# Altium schematic sheet POWER.SchDoc
size A3
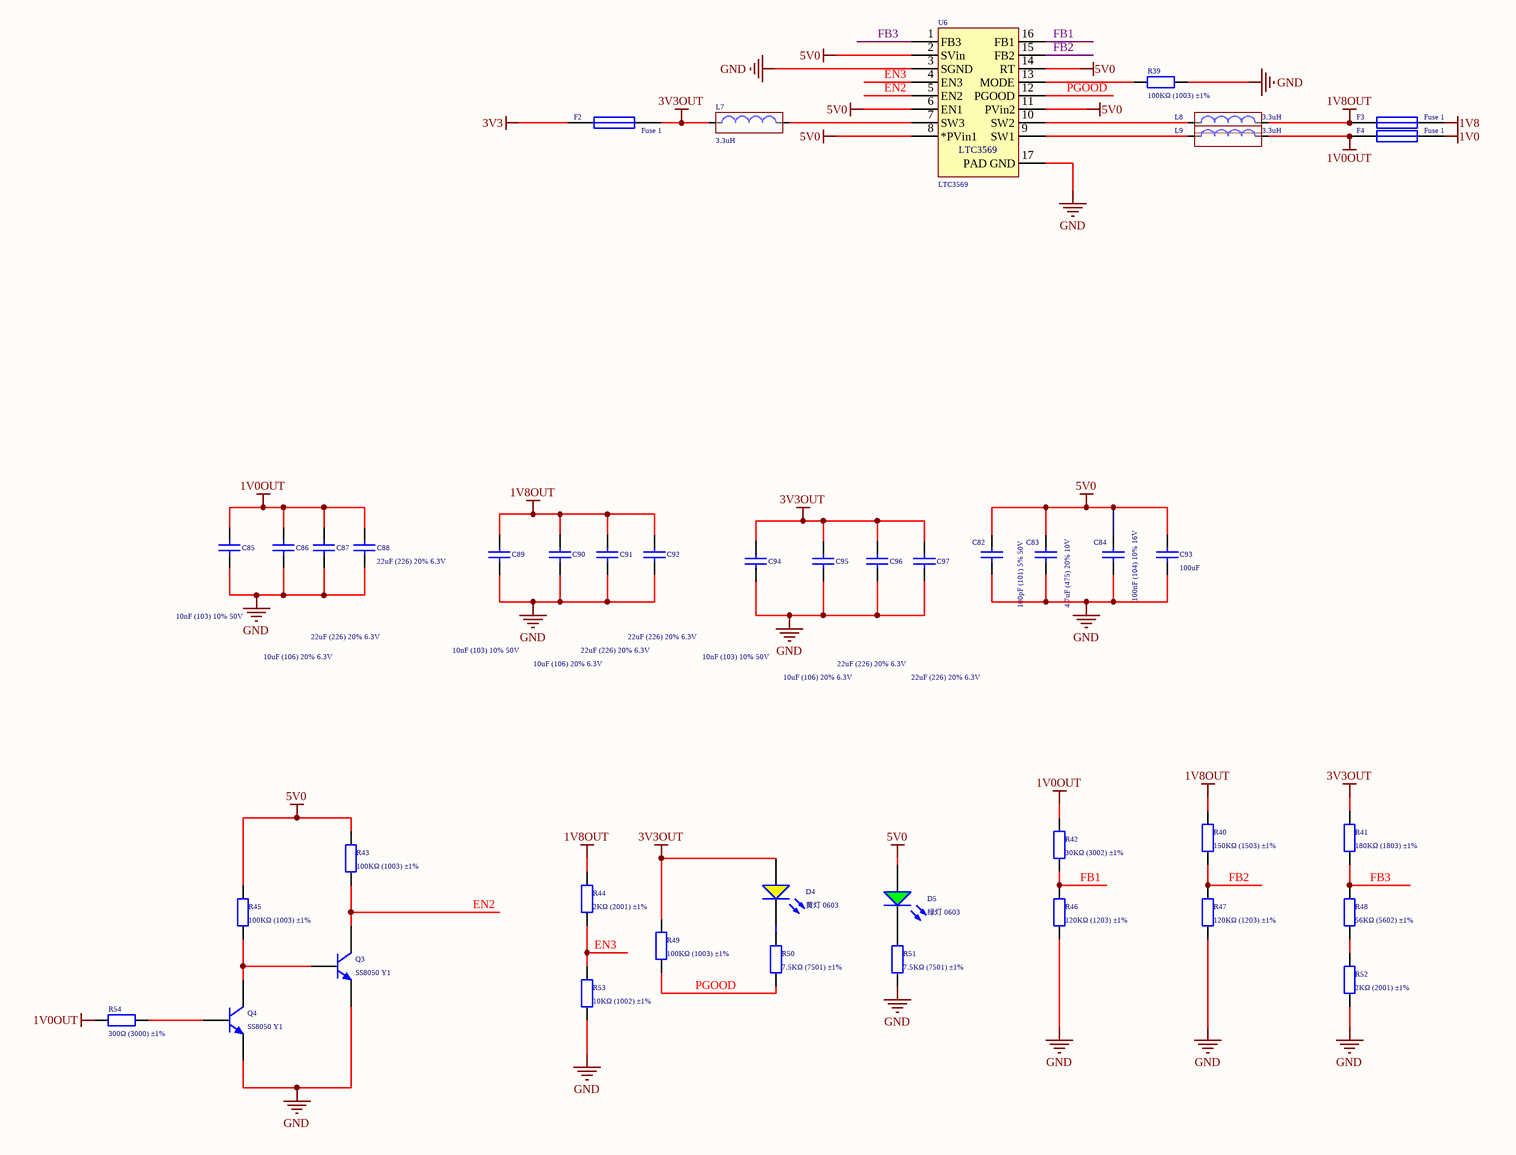
[diagram p0: POWER.SchDoc]

## Parts
C82  100pF (101) 5% 50V  [0402_C]
C83  4.7uF (475) 20% 10V  [0402_C]
C84  100nF (104) 10% 16V  [0402_C]
C85  10nF (103) 10% 50V  [0402_C]
C86  10uF (106) 20% 6.3V  [0402_C]
C87  22uF (226) 20% 6.3V  [0603_C]
C88  22uF (226) 20% 6.3V  [0603_C]
C89  10nF (103) 10% 50V  [0402_C]
C90  10uF (106) 20% 6.3V  [0402_C]
C91  22uF (226) 20% 6.3V  [0603_C]
C92  22uF (226) 20% 6.3V  [0603_C]
C93  value 100uF  [LC-1206]  (hidden comment: Cap)
C94  10nF (103) 10% 50V  [0402_C]
C95  10uF (106) 20% 6.3V  [0402_C]
C96  22uF (226) 20% 6.3V  [0603_C]
C97  22uF (226) 20% 6.3V  [0603_C]
D4  黄灯 0603  [0603_LED_S1]
D5  绿灯 0603  [0603_LED_S1]
F2  Fuse 1  [1206]
F3  Fuse 1  [1206]
F4  Fuse 1  [1206]
L7  3.3uH  [LC-1210]
L8  3.3uH  [LC-1210]
L9  3.3uH  [LC-1210]
Q3  SS8050 Y1  [SOT-23(SOT-23-3)]
Q4  SS8050 Y1  [SOT-23(SOT-23-3)]
R39  100KΩ (1003) ±1%  [0402_R]
R40  150KΩ (1503) ±1%  [0402_R]
R41  180KΩ (1803) ±1%  [0603_R]
R42  30KΩ (3002) ±1%  [0603_R]
R43  100KΩ (1003) ±1%  [0402_R]
R44  2KΩ (2001) ±1%  [0402_R]
R45  100KΩ (1003) ±1%  [0402_R]
R46  120KΩ (1203) ±1%  [0402_R]
R47  120KΩ (1203) ±1%  [0402_R]
R48  56KΩ (5602) ±1%  [0402_R]
R49  100KΩ (1003) ±1%  [0402_R]
R50  7.5KΩ (7501) ±1%  [0402_R]
R51  7.5KΩ (7501) ±1%  [0402_R]
R52  2KΩ (2001) ±1%  [0402_R]
R53  10KΩ (1002) ±1%  [0402_R]
R54  300Ω (3000) ±1%  [0402_R]
U6  LTC3569  [SOP127P600-16N]

## Nets
1V0: F4.1
1V0OUT: C85.2 C86.2 C87.2 C88.2 F4.2 L9.2 R42.2 R54.1
1V8: F3.1
1V8OUT: C89.2 C90.2 C91.2 C92.2 F3.2 L8.2 R40.2 R44.2
3V3: F2.2
3V3OUT: C94.2 C95.2 C96.2 C97.2 D4.A F2.1 L7.1 R41.2 R49.2
5V0: C82.2 C83.1 C84.2 C93.2 D5.A R43.2 R45.2 U6.2(SVin) U6.6(EN1) U6.8(*PVin1) U6.11(PVin2) U6.14(RT)
GND: C82.1 C83.2 C84.1 C85.1 C86.1 C87.1 C88.1 C89.1 C90.1 C91.1 C92.1 C93.1 C94.1 C95.1 C96.1 C97.1 Q3.2(E) Q4.2(E) R39.2 R46.1 R47.1 R51.1 R52.1 R53.1 U6.3(SGND) U6.17(PAD_GND)
EN2: Q3.3(C) R43.1 U6.5(EN2)
EN3: R44.1 R53.2 U6.4(EN3)
FB1: R42.1 R46.2 U6.16(FB1)
FB2: R40.1 R47.2 U6.15(FB2)
FB3: R41.1 R48.2 U6.1(FB3)
PGOOD: R49.1 R50.1 U6.12(PGOOD)
NetD4_K: D4.K R50.2
NetD5_K: D5.K R51.2
NetL7_2: L7.2 U6.7(SW3)
NetL8_1: L8.1 U6.10(SW2)
NetL9_1: L9.1 U6.9(SW1)
NetQ3_1: Q3.1(B) Q4.3(C) R45.1
NetQ4_1: Q4.1(B) R54.2
NetR39_1: R39.1 U6.13(MODE)
NetR48_1: R48.1 R52.2

## Library data of the parts
C82 = 0402 100pF (101) 5% 50V: 贴片电容; ComponentLink1Description: 供应商链接; ComponentLink1URL: http://www.szlcsc.com/product/details_1898.html; Package: 0402; Supplier: LC; SuppliersPartNumber: C1546
C83 = 0402 4.7uF (475) 20% 10V: 贴片电容; ComponentLink1Description: 供应商链接; ComponentLink1URL: http://www.szlcsc.com/product/details_24469.html; Package: 0402; Supplier: LC; SuppliersPartNumber: C23733
C84 = 0402 100nF (104) 10% 16V: 贴片电容; ComponentLink1Description: 供应商链接; ComponentLink1URL: http://www.szlcsc.com/product/details_1877.html; Package: 0402; Supplier: LC; SuppliersPartNumber: C1525
C85 C89 C94 = 0402 10nF (103) 10% 50V: 贴片电容; ComponentLink1Description: 供应商链接; ComponentLink1URL: http://www.szlcsc.com/product/details_15869.html; Package: 0402; Supplier: LC; SuppliersPartNumber: C15195
C86 C90 C95 = 0402 10uF (106) 20% 6.3V: 贴片电容; ComponentLink1Description: 供应商链接; ComponentLink1URL: http://www.szlcsc.com/product/details_16204.html; Package: 0402; Supplier: LC; SuppliersPartNumber: C15525
C87 C88 C91 C92 C96 C97 = 0603 22uF (226) 20% 6.3V: 贴片电容; ComponentLink1Description: 供应商链接; ComponentLink1URL: http://www.szlcsc.com/product/details_60514.html; Package: 0603; Supplier: LC; SuppliersPartNumber: C59461
C93 = Cap: 贴片电容; Published: 8-Jun-2000; LatestRevisionDate: 17-Jul-2002; LatestRevisionNote: Re-released for DXP Platform.; PackageReference: RAD-0.3; Publisher: Altium Limited
D4 = 0603 黄灯: 发光二极管; ComponentLink1Description: 供应商链接; ComponentLink1URL: http://www.szlcsc.com/product/details_73147.html; Package: 0603; Supplier: LC; SuppliersPartNumber: C72038
D5 = 0603 绿灯: 发光二极管; ComponentLink1Description: 供应商链接; ComponentLink1URL: http://www.szlcsc.com/product/details_73152.html; Package: 0603; Supplier: LC; SuppliersPartNumber: C72043
F2-F4 = Fuse 1: Fuse; Published: 8-Jun-2000; LatestRevisionDate: 17-Jul-2002; LatestRevisionNote: Re-released for DXP Platform.; PackageReference: PIN-W2/E2.8; Publisher: Altium Limited; PackageDescription: Thru-Hole; 2 Leads
L7-L9 = Inductor_1: Inductor
Q3 Q4 = SOT-23 SS8050 Y1: 三极管; ComponentLink1Description: 供应商链接; ComponentLink1URL: http://www.szlcsc.com/product/details_2507.html; Package: SOT-23; Supplier: LC; SuppliersPartNumber: C2150
R39 R43 R45 R49 = 0402 100KΩ (1003) 1%: 贴片电阻; ComponentLink1Description: 供应商链接; ComponentLink1URL: http://www.szlcsc.com/product/details_26484.html; Package: 0402; Supplier: LC; SuppliersPartNumber: C25741
R40 = 0402 150KΩ (1503) 1%: 贴片电阻; ComponentLink1Description: 供应商链接; ComponentLink1URL: http://www.szlcsc.com/product/details_26498.html; Package: 0402; Supplier: LC; SuppliersPartNumber: C25755
R41 = 0603 180KΩ (1803) 1%: 贴片电阻; ComponentLink1Description: 供应商链接; ComponentLink1URL: http://www.szlcsc.com/product/details_23554.html; Package: 0603; Supplier: LC; SuppliersPartNumber: C22827
R42 = 0603 30KΩ (3002) 1%: 贴片电阻; ComponentLink1Description: 供应商链接; ComponentLink1URL: http://www.szlcsc.com/product/details_23711.html; Package: 0603; Supplier: LC; SuppliersPartNumber: C22984
R44 R52 = 0402 2KΩ (2001) 1%: 贴片电阻; ComponentLink1Description: 供应商链接; ComponentLink1URL: http://www.szlcsc.com/product/details_4516.html; Package: 0402; Supplier: LC; SuppliersPartNumber: C4109
R46 R47 = 0402 120KΩ (1203) 1%: 贴片电阻; ComponentLink1Description: 供应商链接; ComponentLink1URL: http://www.szlcsc.com/product/details_26493.html; Package: 0402; Supplier: LC; SuppliersPartNumber: C25750
R48 = 0402 56KΩ (5602) 1%: 贴片电阻; ComponentLink1Description: 供应商链接; ComponentLink1URL: http://www.szlcsc.com/product/details_26539.html; Package: 0402; Supplier: LC; SuppliersPartNumber: C25796
R50 R51 = 0402 7.5KΩ (7501) 1%: 贴片电阻; ComponentLink1Description: 供应商链接; ComponentLink1URL: http://www.szlcsc.com/product/details_26661.html; Package: 0402; Supplier: LC; SuppliersPartNumber: C25918
R53 = 0402 10KΩ (1002) 1%: 贴片电阻; ComponentLink1Description: 供应商链接; ComponentLink1URL: http://www.szlcsc.com/product/details_26487.html; Package: 0402; Supplier: LC; SuppliersPartNumber: C25744
R54 = 0402 300Ω (3000) 1%: 贴片电阻; ComponentLink1Description: 供应商链接; ComponentLink1URL: http://www.szlcsc.com/product/details_25845.html; Package: 0402; Supplier: LC; SuppliersPartNumber: C25102